# EAGLE schematic f6_Pluse (EAGLE 7.2.0)
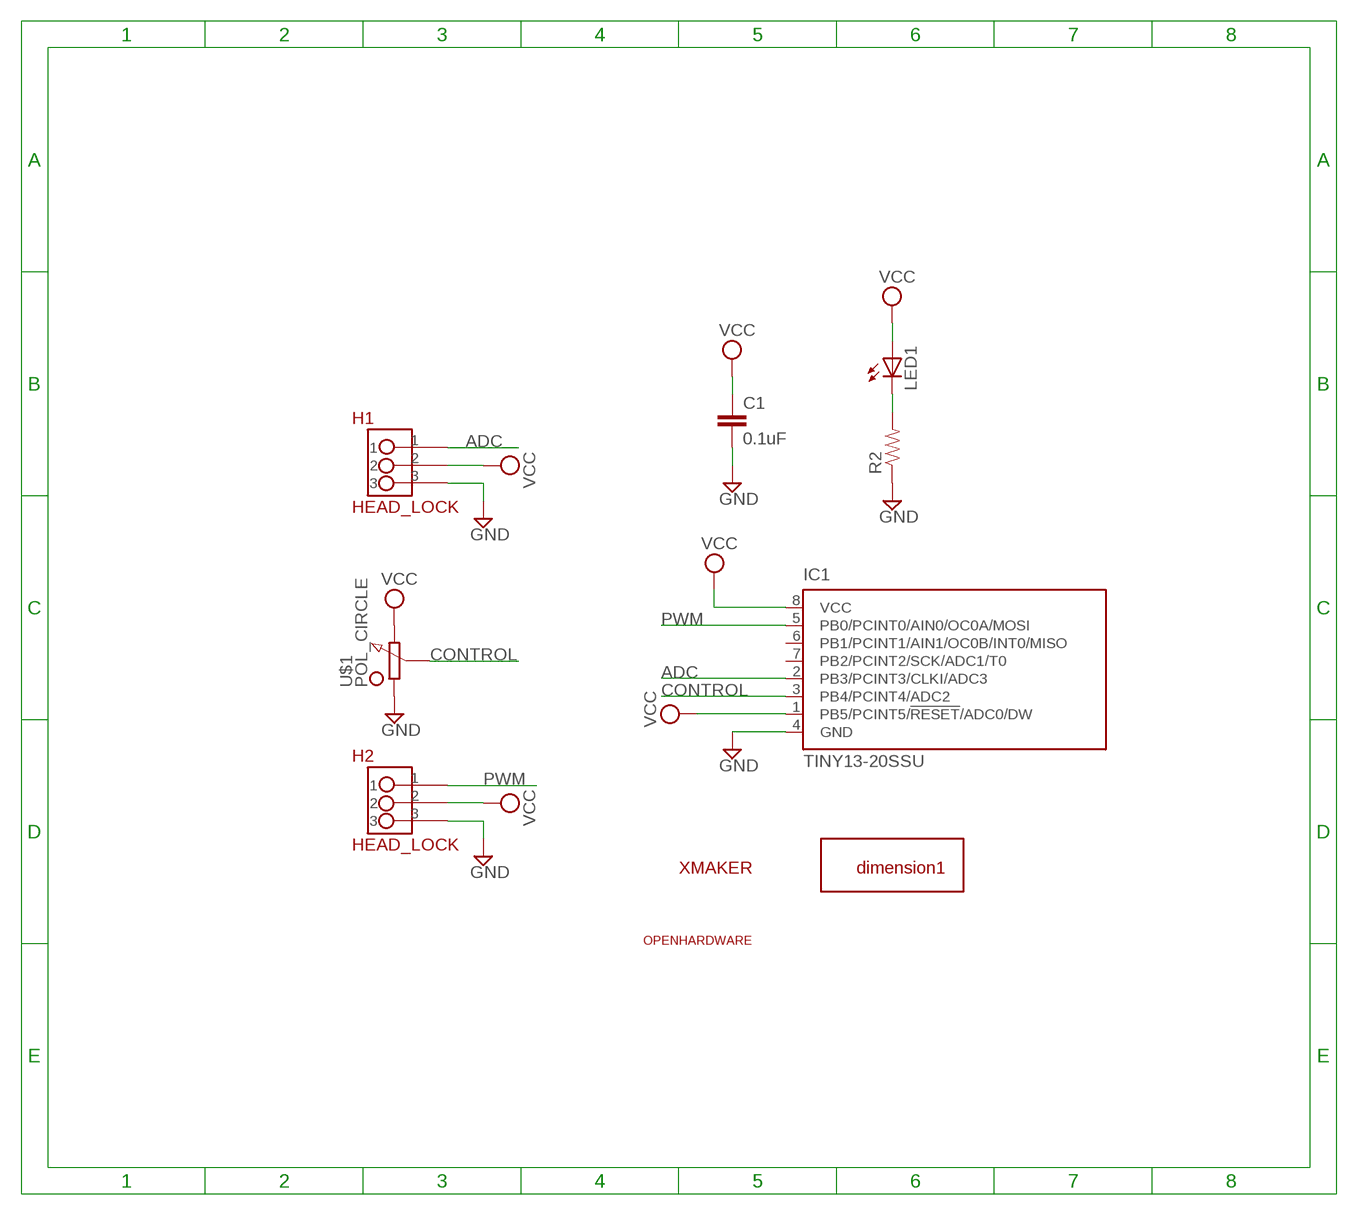
[diagram p0: schematic, sheet 1]

## Parts
C1  0.1uF  CAP0603-CAP  [0603-CAP]
H1  HEAD_LOCK  [HEAD_LOCK]
H2  HEAD_LOCK  [HEAD_LOCK]
IC1  TINY13-20SSU  [8S1]
LED1  LED_ESML0603  [LED_SML0603]
R2  0.27OHM-1/10W-1%(0603)  [0603-RES]
U$1  POL_CIRCLE  [POT_CIRCLE]
U$2  XMAKERLOGO2  [XMAKERLOGO2]
U$3  DIMENSION1  [DIMENSION1]
U$4  OPENHARDWARE  [OPENHARDWARE]

## Nets
ADC: H1.1 IC1.2(PB3/PCINT3/CLKI/ADC3)
CONTROL: IC1.3(PB4/PCINT4/ADC2) U$1.P$2
GND: C1.2 H1.3 H2.3 IC1.4(GND) R2.1 U$1.P$3
N$1: LED1.C R2.2
PWM: H2.1 IC1.5(PB0/PCINT0/AIN0/OC0A/MOSI)
VCC: C1.1 H1.2 H2.2 IC1.1(PB5/PCINT5/!RESET!/ADC0/DW) IC1.8(VCC) LED1.A U$1.P$1
Unconnected: IC1.6(PB1/PCINT1/AIN1/OC0B/INT0/MISO) IC1.7(PB2/PCINT2/SCK/ADC1/T0)

## Library data of the parts
C1 = SparkFun-Passives:CAP: Capacitor Standard 0603 ceramic capacitor, and 0.1" leaded capacitor.
H1 H2 = HEAD_LOCK:HEAD_LOCK: 带锁的排座
IC1 = atmel:TINY13: 8-bit AVR Microcontroller with 1K Bytes In-System Programmable Flash Source: http://www.atmel.com/dyn/resources/prod_documents/2535S.pdf; MPN: ATTINY13-20SSU; OC_FARNELL: 1455133; OC_NEWARK: 58M3771
LED1 = eagle-ltspice:LED_E: LED Source: http://www.osram.convergy.de Source: www.luxeon.com Source: www.kingbright.com; SPICEMODEL: NONE; SPICEPREFIX: D; SPICETYPE: diode
R2 = SparkFun-Resistors:0.27OHM-1/10W-1%(0603): RES-08787; PROD_ID: RES-08787
U$1 = Xmaker_yuhui:POL_CIRCLE
U$2 = Xmaker_yuhui:XMAKERLOGO2
U$3 = Xmaker_yuhui:DIMENSION1
U$4 = Xmaker_yuhui:OPENHARDWARE